# EAGLE design EstacionESP8266_v1 (EAGLE 9.1.1)
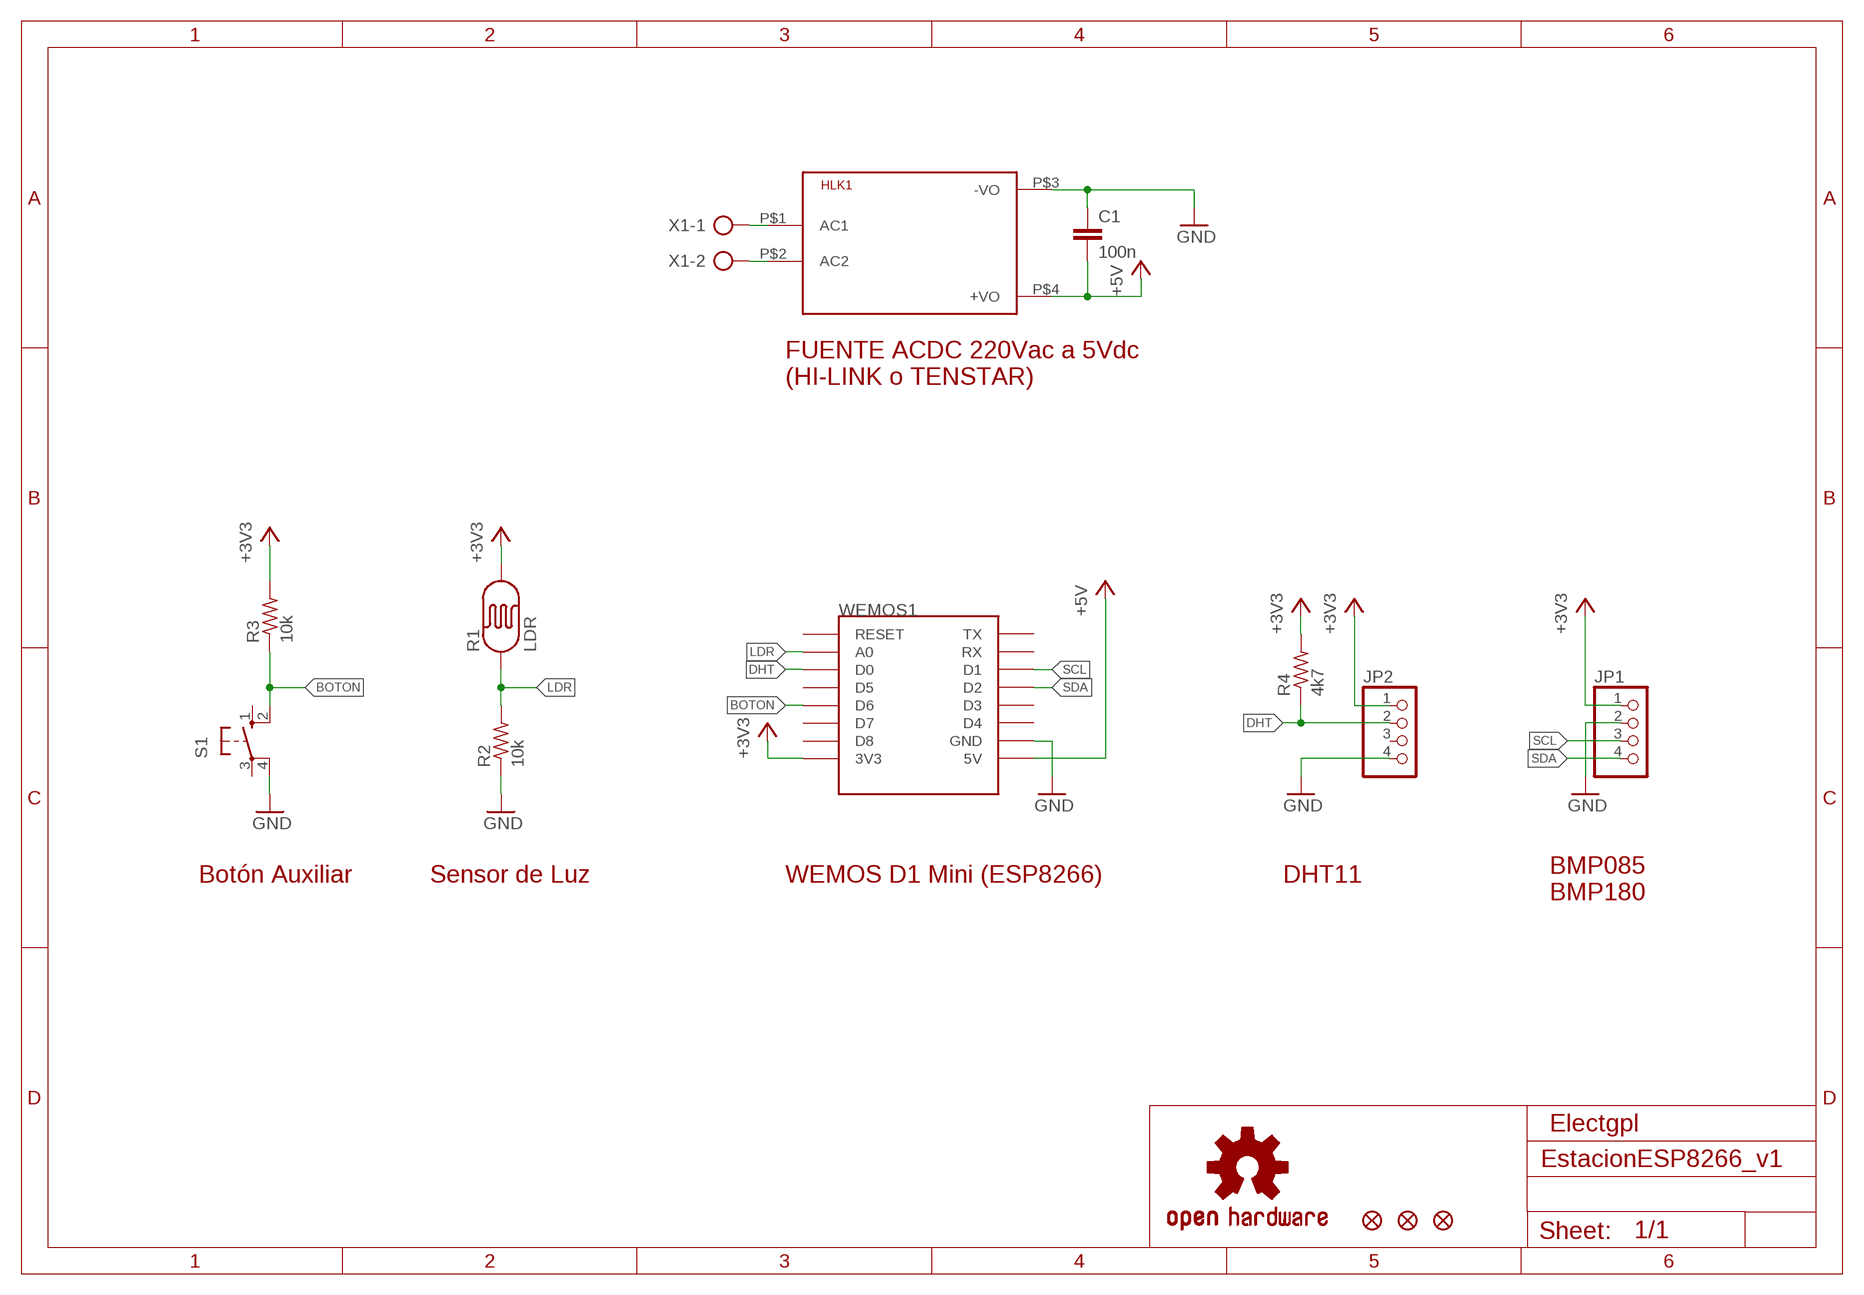
[diagram p0: schematic, sheet 1]

## Parts
C1  100n  C-EU050-024X044  [C050-024X044]
HLK1  HLK-PM013W  [HLK-PM01]
JP1  PINHD-1X4  [1X04]
JP2  PINHD-1X4  [1X04]
JP3  FIDUCIAL1.5X3  [FIDUCIAL-1.5X3]
JP4  FIDUCIAL1.5X3  [FIDUCIAL-1.5X3]
JP5  FIDUCIAL1.5X3  [FIDUCIAL-1.5X3]
R1  LDR  PHOTOCELLPTH  [PHOTOCELL]
R2  10k  R-US_0204/7  [0204/7]
R3  10k  R-US_0204/7  [0204/7]
R4  4k7  R-US_0204/7  [0204/7]
S1  10-XX  [B3F-10XX]
U$5  OSHW-LOGOM  [OSHW-LOGO-M]
WEMOS1  WEMOS-D1-MINI  [WEMOS-D1-MINI]
X1  AK500/2  [AK500/2]

## Nets
+3V3: JP1.1 JP2.1 R1.2 R3.2 R4.2 WEMOS1.3V3
+5V: C1.2 HLK1.P$4(+VO) WEMOS1.5V
BOTON: R3.1 S1.2(S1) WEMOS1.D6
DHT: JP2.2 R4.1 WEMOS1.D0
GND: C1.1 HLK1.P$3(-VO) JP1.2 JP2.4 R2.1 S1.4(P1) WEMOS1.GND
LDR: R1.1 R2.2 WEMOS1.A0
N$1: HLK1.P$1(AC1) X1.1
N$2: HLK1.P$2(AC2) X1.2
SCL: JP1.3 WEMOS1.D1
SDA: JP1.4 WEMOS1.D2
Unconnected: JP2.3 S1.1(S) S1.3(P) WEMOS1.D3 WEMOS1.D4 WEMOS1.D5 WEMOS1.D7 WEMOS1.D8 WEMOS1.RESET WEMOS1.RX WEMOS1.TX

## Notes on the sheet
- FUENTE ACDC 220Vac a 5Vdc
  (HI-LINK o TENSTAR)
- Botón Auxiliar | Sensor de Luz | WEMOS D1 Mini (ESP8266) | DHT11
- BMP085
  BMP180
- Electgpl

## Library data of the parts
C1 = rcl:C-EU: CAPACITOR, European symbol; SPICEPREFIX: C
HLK1 = HLK-PM01:HLK-PM01: Hi-Link Power Supply HLK-PM01 3W Author: Ahmed Said <https://github.com/AhmedSaid/EAGLELibraries>
JP1 JP2 = pinhead:PINHD-1X4: PIN HEADER
JP3-JP5 = SparkFun-Aesthetics:FIDUCIAL: Fiducial Alignment Points Various fiducial points for machine vision alignment.
R1 = SparkFun:PHOTOCELL: Photocell Also known as a CdS photoresistor. This is a low cost way to detect light levels. Resistance decreases with more incoming light. SparkFun SKU: SEN-09088
R2-R4 = rcl:R-US_: RESISTOR, American symbol; SPICEPREFIX: R
S1 = switch-omron:10-XX: OMRON SWITCH; MPN: B3F-1000; OC_FARNELL: 176432; OC_NEWARK: 36M3542
U$5 = SparkFun-Aesthetics:OSHW-LOGO: Open Source Hardware Logo This logo indicates the piece of hardware it is found on incorporates a OSHW license and/or adheres to the definition of open source hardware found here: http://freedomdefined.org/OSHW
WEMOS1 = esp8266modules:WEMOS-D1-MINI: WeMos.cc D1 mini ESP8266 module
X1 = con-ptr500:AK500/2: CONNECTOR; OC_FARNELL: unknown; OC_NEWARK: unknown

## Board
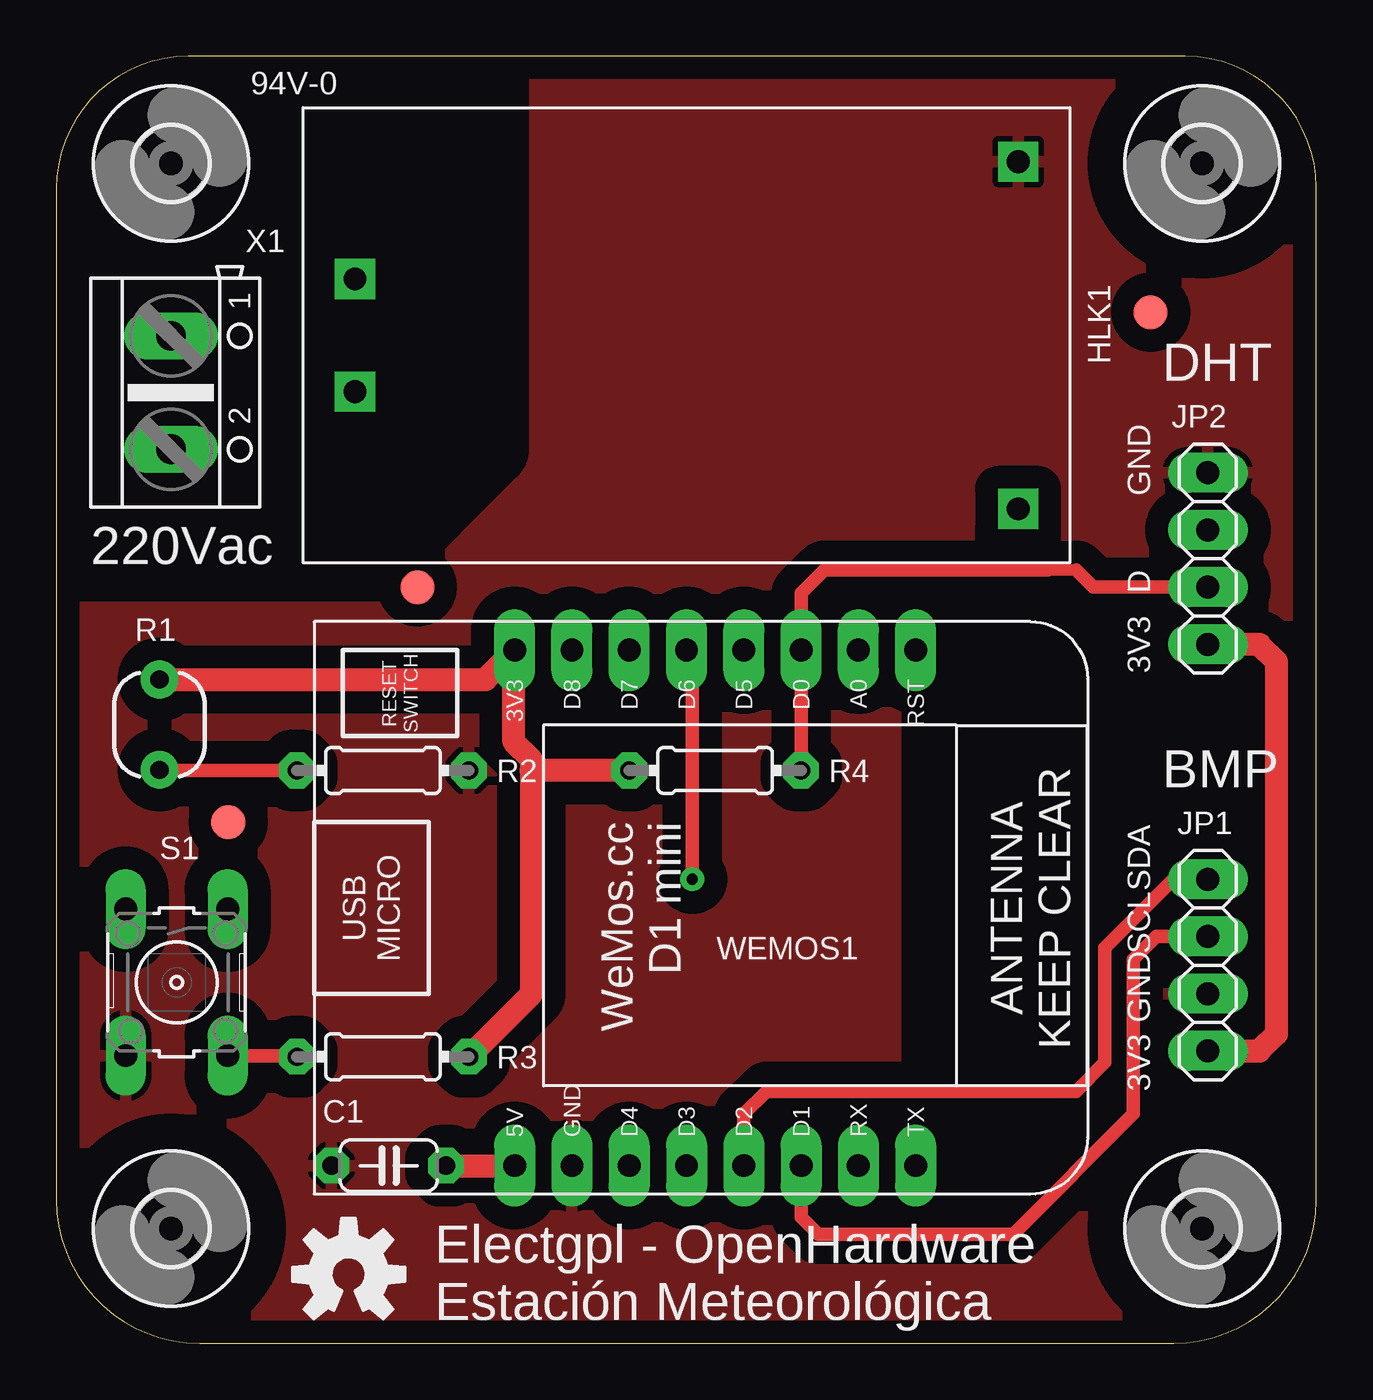
[diagram p1: board, top side]
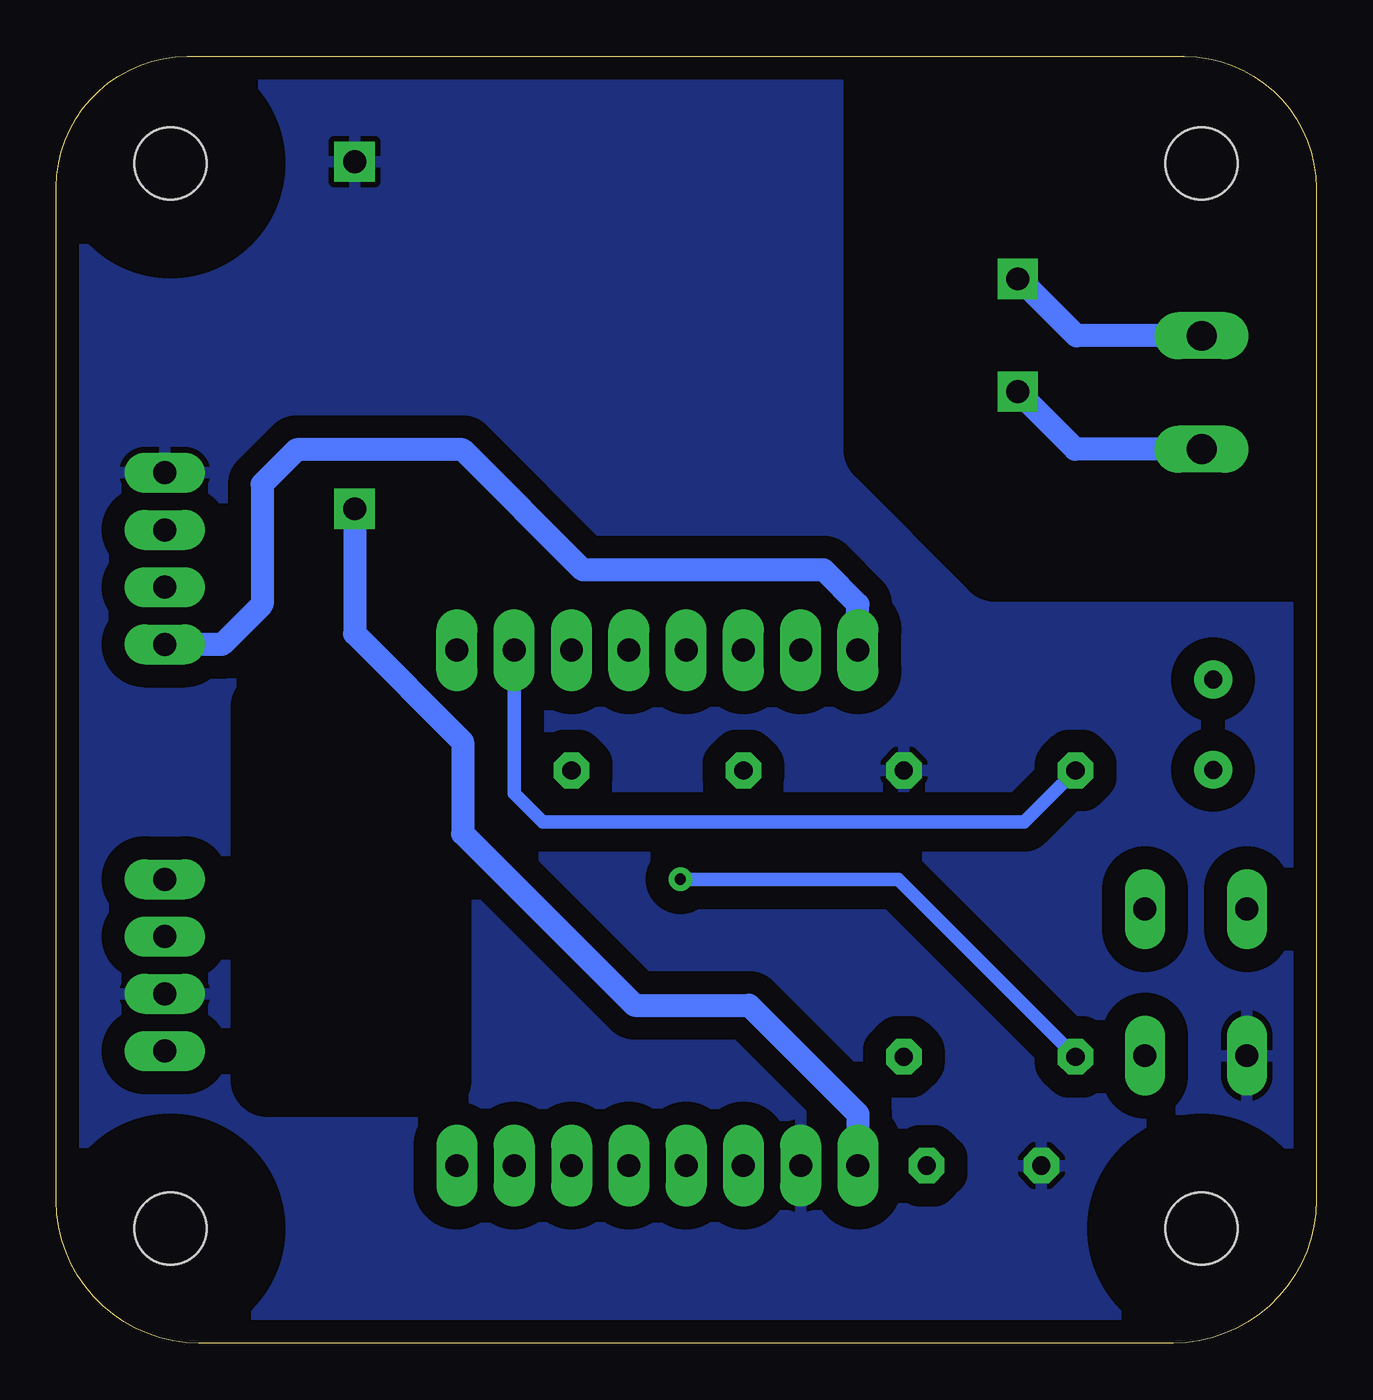
[diagram p2: board, bottom side, seen from below]

Size 55.86 x 57.07 mm. Coordinates in mm from the lower left corner, seen from the top.
Outline: 0,51.23 0,6.35 arc90 6.35,0 49.54,0 arc90 55.86,6.32 55.86,51.26 arc90 50.05,57.07 5.85,57.07 arc90 0,51.23
Copper layers (1*16): Top 0.035mm / dielectric 1.5mm / Bottom 0.035mm
Design rules "default *": minimum track width 6mil, minimum drill 0.35mm, track to track 6mil, track to pad 6mil, pad to pad 6mil, via to via 6mil, smd to smd 6mil, copper to edge 40mil, drill to drill 6mil, minimum pad ring 15mil, minimum via ring 8mil, stop-mask expansion 4mil, vias tented up to drill 0mil, thermal gap 10mil
tRestrict: area 1.3,34.5 to 19.3,56.1; area 39.1,11.2 to 46.5,28.2
bRestrict: area 1.3,34.5 to 19.3,56.1; area 39.1,11.7 to 46.5,28.2

### Footprints (pad centres in the part's own frame; a part is rotated, then mirrored left to right if it is on the bottom)
C050-024X044 = drill 0.813 octagon: 1 -2.54,0; 2 2.54,0
HLK-PM01 = drill 1.016 square: P$1 -14.7,2.5; P$2 -14.7,-2.5; P$3 14.7,7.7; P$4 14.7,-7.7
1X04 = drill 1.016 long: 1 -3.81,0; 2 -1.27,0; 3 1.27,0; 4 3.81,0
FIDUCIAL-1.5X3 = smd 1.5 x 1.5: 1 0,0
PHOTOCELL = drill 0.8 pad 1.676: 1 -2,0; 2 2,0
0204/7 = drill 0.813 octagon: 1 -3.81,0; 2 3.81,0
B3F-10XX = drill 1.016 long: 1 -3.251,2.261; 2 3.251,2.261; 3 -3.251,-2.261; 4 3.251,-2.261
3,2 = hole 3.2: 0,0
WEMOS-D1-MINI = drill 1.016 pad 1.829 long: 3V3 -10.16,-10.16; 5V 12.7,-10.16; A0 -10.16,5.08; D0 -10.16,2.54; D1 12.7,2.54; D2 12.7,0; D3 12.7,-2.54; D4 12.7,-5.08; D5 -10.16,0; D6 -10.16,-2.54; D7 -10.16,-5.08; D8 -10.16,-7.62; GND 12.7,-7.62; RESET -10.16,7.62; RX 12.7,5.08; TX 12.7,7.62
AK500/2 = drill 1.321 long: 1 -2.515,0; 2 2.515,0

### Placement (x,y rotation side)
C1  14.73,7.87 0 top
HLK1  27.94,44.7 0 top
JP1  51.05,16.76 90 top
JP2  51.05,34.8 90 top
JP3  7.62,23.11 0 top
JP4  48.51,45.72 0 top
JP5  16,33.53 0 top
R1  4.57,27.43 90 top
R2  14.48,25.4 180 top
R3  14.48,12.7 0 top
R4  29.21,25.4 180 top
S1  5.33,16 270 top
U$1  [3,2]  50.8,52.32 0 top
U$2  [3,2]  50.8,5.08 0 top
U$3  [3,2]  5.08,5.08 0 top
U$4  [3,2]  5.08,52.32 0 top
U$5  12.95,3.05 0 top
WEMOS1  30.48,20.57 270 top
X1  5.08,42.16 270 top

### Tracks (layer width: path | path; a pad name or v marks a point on that pad's centre or on a via)
+3V3
  Top 1.016: R1.2 19.02,29.43 20.29,30.7 | 20.29,30.7 WEMOS1.3V3 | 20.29,30.7 20.29,26.67 21.05,25.91 21.05,25.4 | R3.2 21.05,15.46 21.05,25.4 | R4.2 21.05,25.4 | JP1.1 53.34,12.95 54.1,13.72 54.1,30.23 53.34,30.99 JP2.1
  Bottom 1.016: WEMOS1.3V3 20.32,32.77 21.84,34.29 32.51,34.29 37.85,39.62 45.21,39.62 46.74,38.1 46.74,32.77 48.51,30.99 JP2.1
+5V
  Top 1.016: C1.2 WEMOS1.5V
  Bottom 1.016: HLK1.P$4 42.64,31.46 37.85,26.67 37.85,22.61 30.23,14.99 25.15,14.99 20.32,10.16 WEMOS1.5V
BOTON  (via drill 0.5 pad 1.05)
  Top 0.508: 10.62,12.75 R3.1 | WEMOS1.D6 28.19,30.48
  Top 0.61: S1.2 10.62,12.75 | 28.19,30.48 v28.19,20.57
  Bottom 0.61: R3.1 18.54,20.57 v28.19,20.57
DHT
  Top 0.508: 43.94,34.29 45.21,34.29
  Top 0.61: R4.1 WEMOS1.D0 33.02,33.27 34.04,34.29 43.94,34.29 | 45.21,34.29 45.97,33.53 JP2.2
GND
  pour Top (isolate 1.016): -2.54,58.67 58.42,58.67 58.42,-2.54 -2.54,-2.54
  pour Bottom (isolate 1.016): -2.54,58.67 63.5,58.67 63.5,-2.54 -2.54,-2.54
LDR
  Top 0.508: R1.1 4.6,25.4
  Top 0.61: 4.6,25.4 R2.2
  Bottom 0.61: WEMOS1.A0 35.56,24.38 34.29,23.11 12.95,23.11 R2.2
N$1
  Bottom 1.016: 5.11,44.7 X1.1 10.63,44.68 13.2,47.24 HLK1.P$1
N$2
  Bottom 1.016: X1.2 10.69,39.65 HLK1.P$2
SCL
  Top 0.61: JP1.3 48.77,18.03 47.75,17.02 47.75,10.16 42.42,4.83 33.78,4.83 33.02,5.59 WEMOS1.D1
SDA
  Top 0.61: JP1.4 49.53,20.57 46.48,17.53 46.48,12.45 45.21,11.18 31.5,11.18 30.48,10.16 WEMOS1.D2

### Text on the board
tNames: 94V-0 | DHT | GND | 220Vac | D | 3V3 | BMP | SDA | SCL | GND | 3V3 | Electgpl - OpenHardware | Estación Meteorológica